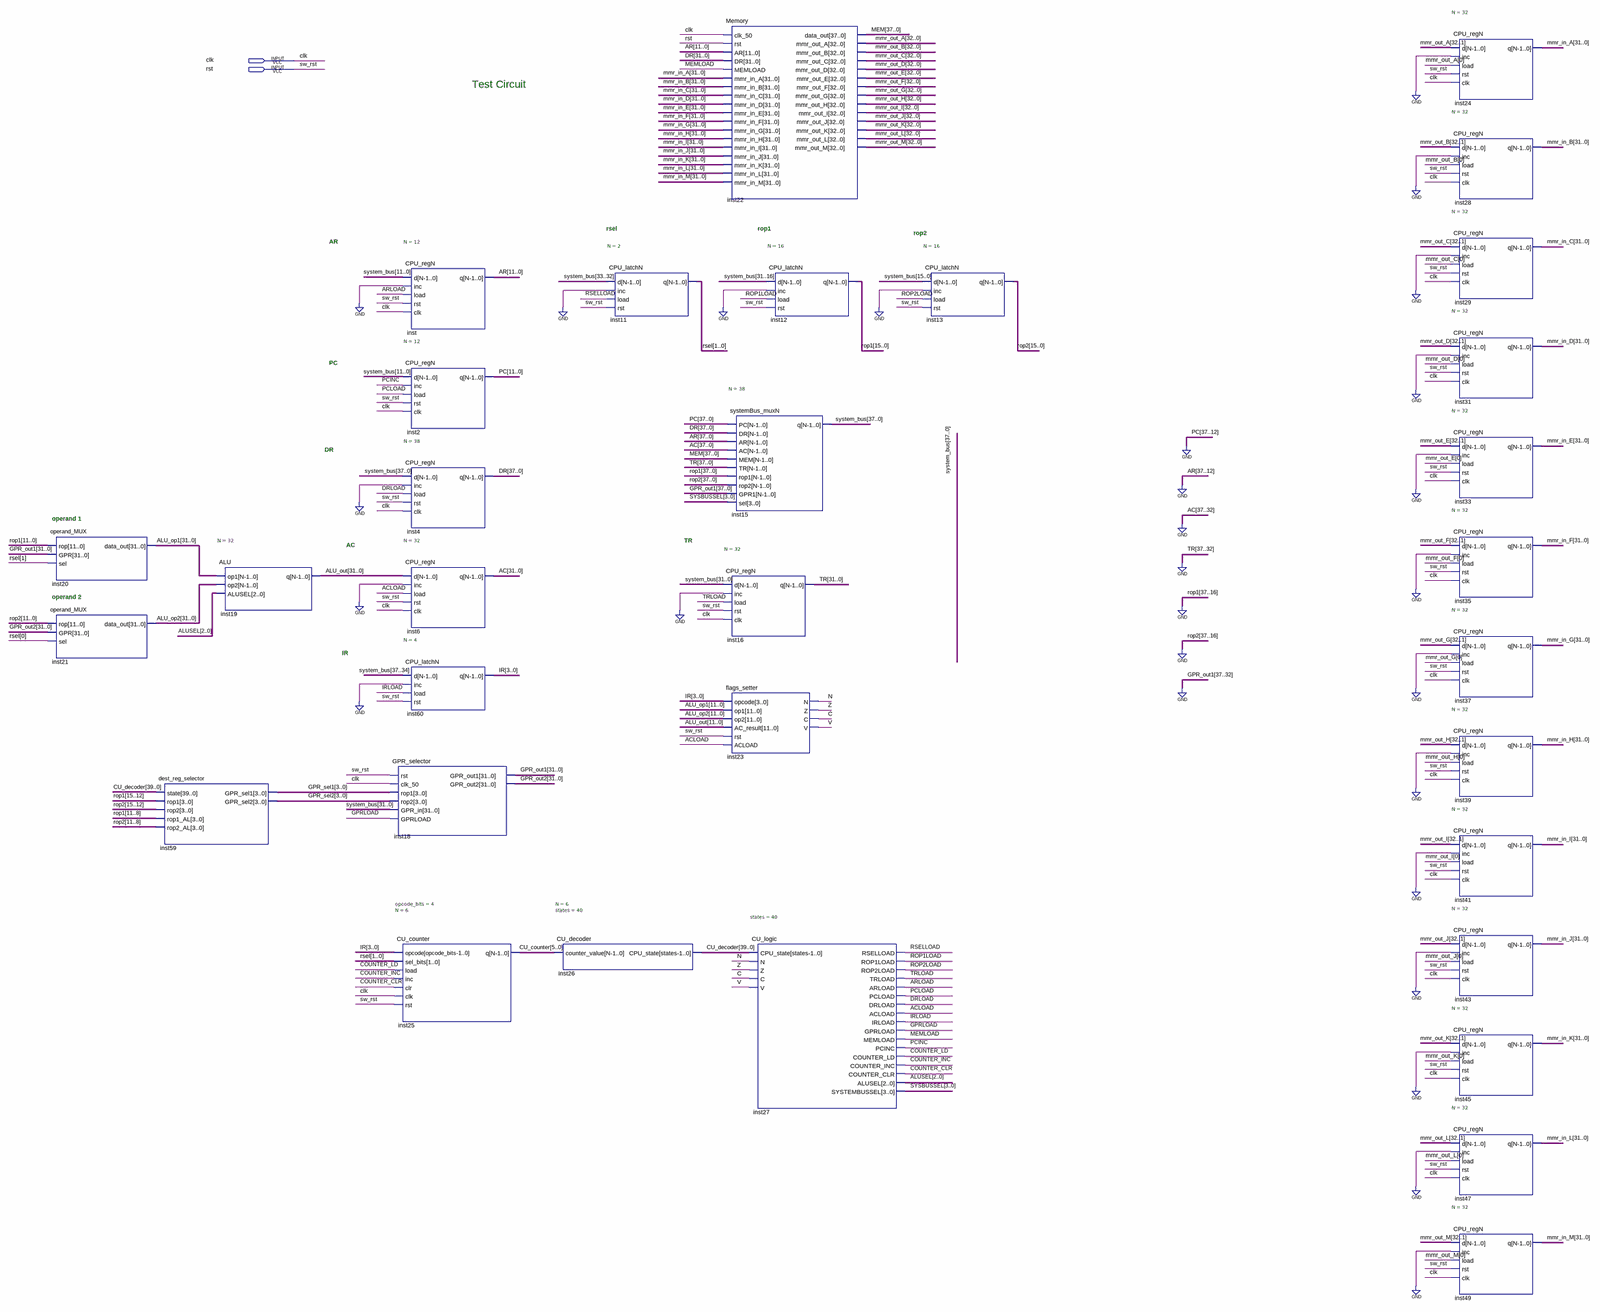
[diagram p0: schematic sheet, whole]
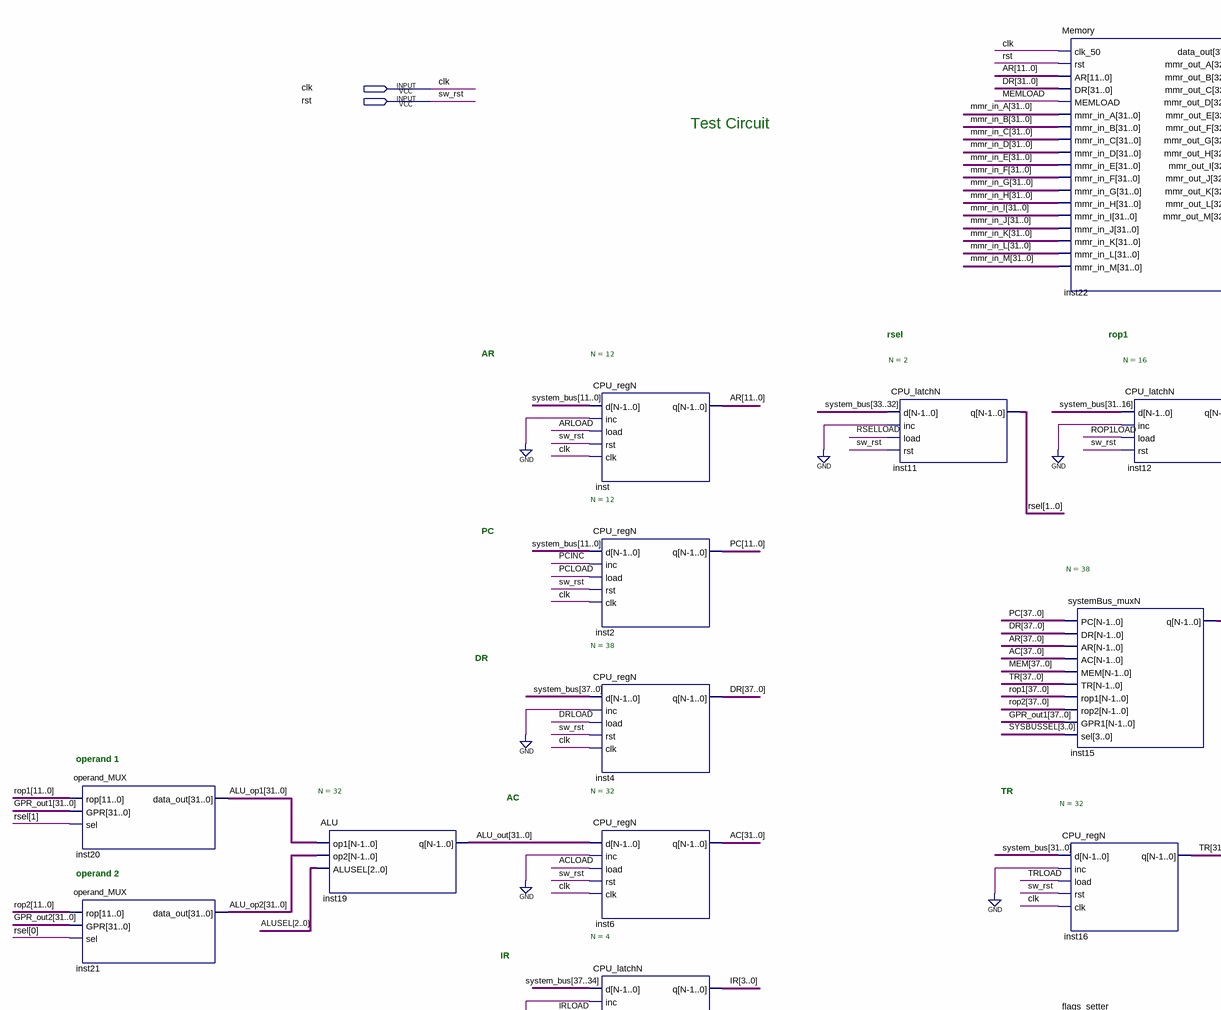
[diagram p1: schematic sheet, upper left part]
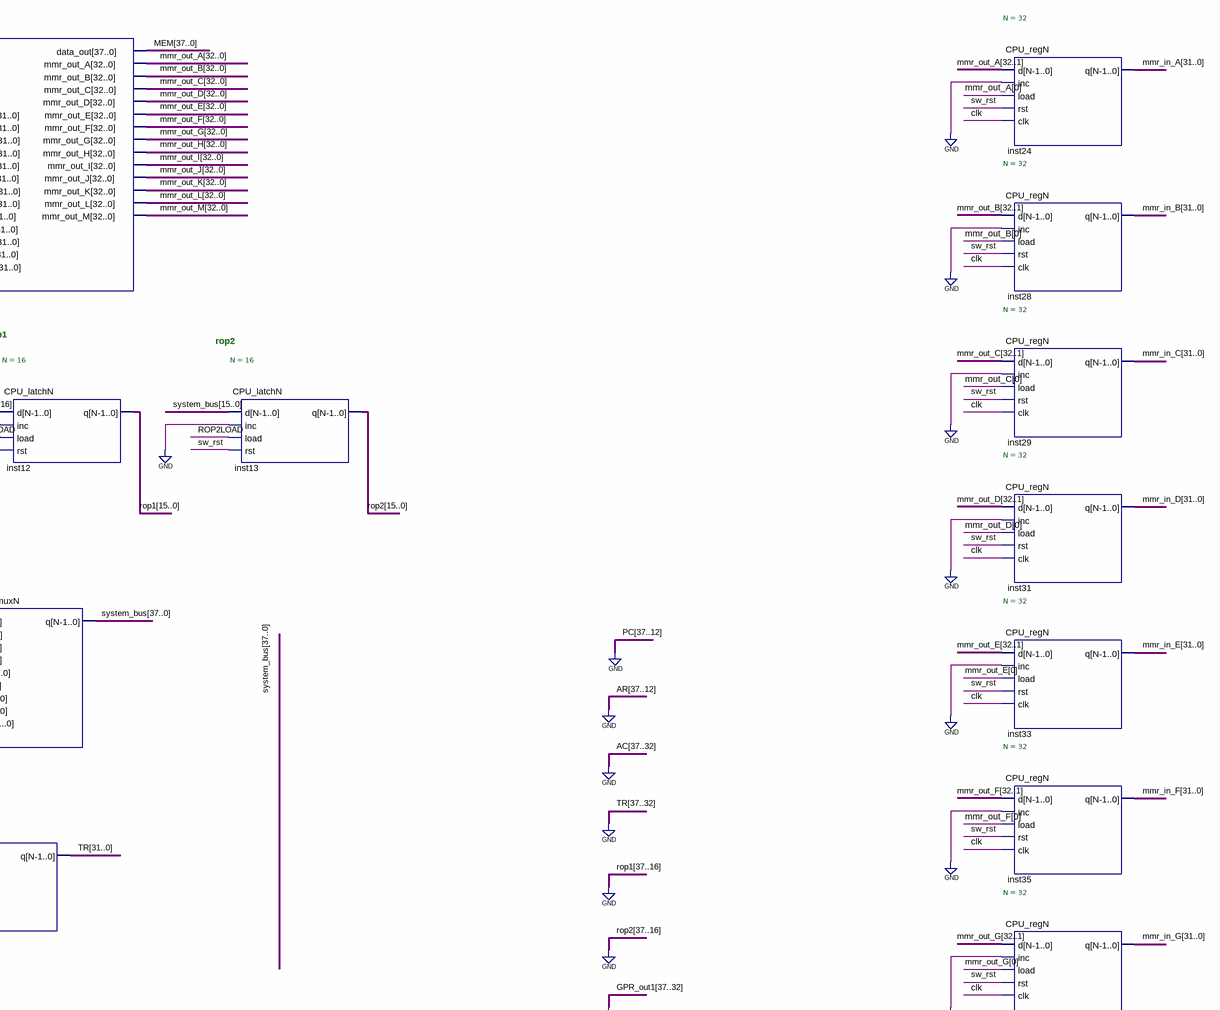
[diagram p2: schematic sheet, upper right part]
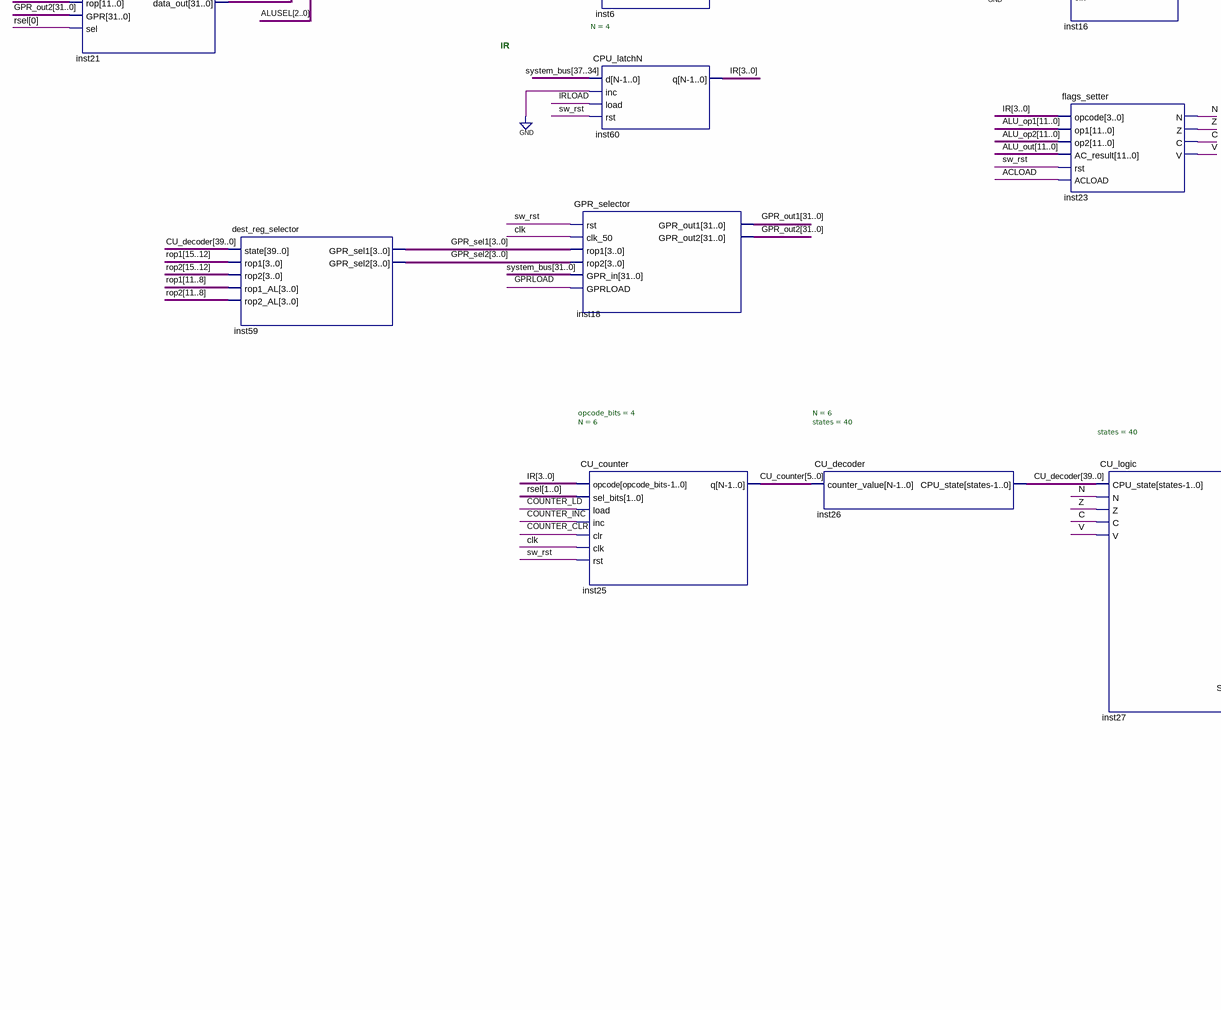
[diagram p3: schematic sheet, lower left part]
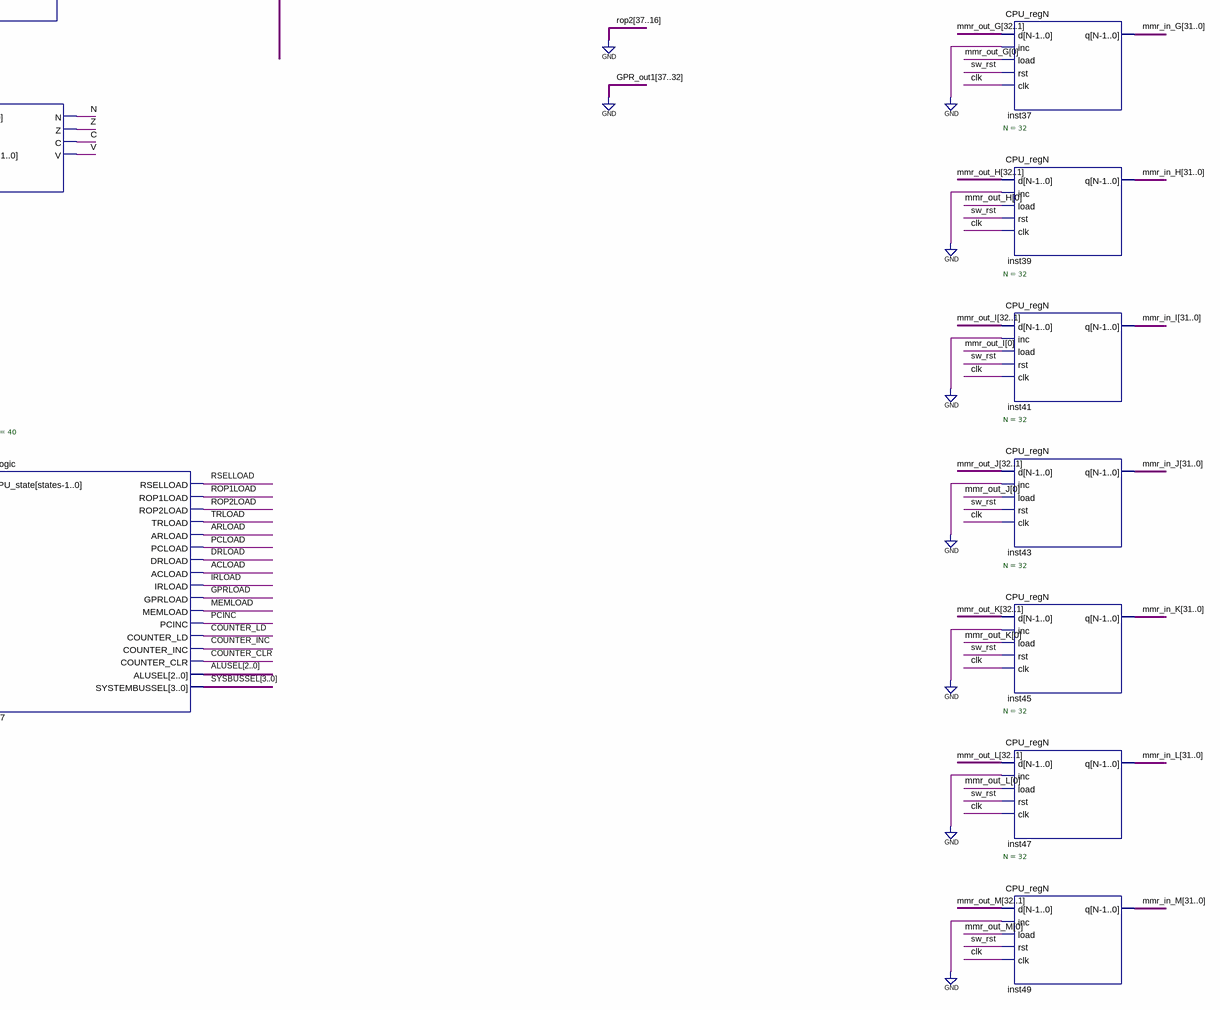
[diagram p4: schematic sheet, lower right part]
// Quartus schematic TestCircuit.bdf as structural Verilog: 33 symbols, 2 pins
module TestCircuit (
  input  clk,
  input  rst
);

  wire ACLOAD, ARLOAD, C, COUNTER_CLR, COUNTER_INC, COUNTER_LD, DRLOAD, GPRLOAD, IRLOAD, MEMLOAD, N, PCINC,
       PCLOAD, ROP1LOAD, ROP2LOAD, RSELLOAD, TRLOAD, V, Z;
  wire [1:0] rsel;
  wire [2:0] ALUSEL;
  wire [3:0] GPR_sel1, GPR_sel2, IR, SYSBUSSEL;
  wire [5:0] CU_counter;
  wire [11:0] AR, PC;
  wire [15:0] rop1, rop2;
  wire [31:0] AC, ALU_op1, ALU_op2, ALU_out, GPR_out1, GPR_out2, mmr_in_A, mmr_in_B, mmr_in_C, mmr_in_D,
       mmr_in_E, mmr_in_F, mmr_in_G, mmr_in_H, mmr_in_I, mmr_in_J, mmr_in_K, mmr_in_L, mmr_in_M, TR;
  wire [32:0] mmr_out_A, mmr_out_B, mmr_out_C, mmr_out_D, mmr_out_E, mmr_out_F, mmr_out_G, mmr_out_H,
       mmr_out_I, mmr_out_J, mmr_out_K, mmr_out_L, mmr_out_M;
  wire [37:0] DR, MEM, system_bus;
  wire [39:0] CU_decoder;

  operand_MUX inst20 (.rop(rop1[11:0]), .GPR(GPR_out1), .sel(rsel[1]), .data_out(ALU_op1));
  operand_MUX inst21 (.rop(rop2[11:0]), .GPR(GPR_out2), .sel(rsel[0]), .data_out(ALU_op2));
  dest_reg_selector inst59 (
    .state(CU_decoder), .rop1(rop1[15:12]), .rop2(rop2[15:12]), .rop1_AL(rop1[11:8]), .rop2_AL(rop2[11:8]),
    .GPR_sel1(GPR_sel1), .GPR_sel2(GPR_sel2));
  ALU #(.N(32)) inst19 (.op1(ALU_op1), .op2(ALU_op2), .ALUSEL(ALUSEL), .q(ALU_out));
  GPR_selector inst18 (
    .rst(rst), .clk_50(clk), .rop1(GPR_sel1), .rop2(GPR_sel2), .GPR_in(system_bus[31:0]), .GPRLOAD(GPRLOAD),
    .GPR_out1(GPR_out1), .GPR_out2(GPR_out2));
  CPU_regN #(.N(12)) inst (.d(system_bus[11:0]), .inc(1'b0), .load(ARLOAD), .rst(rst), .clk(clk), .q(AR));
  CPU_regN #(.N(12)) inst2 (.d(system_bus[11:0]), .inc(PCINC), .load(PCLOAD), .rst(rst), .clk(clk), .q(PC));
  CPU_regN #(.N(38)) inst4 (.d(system_bus), .inc(1'b0), .load(DRLOAD), .rst(rst), .clk(clk), .q(DR));
  CPU_regN #(.N(32)) inst6 (.d(ALU_out), .inc(1'b0), .load(ACLOAD), .rst(rst), .clk(clk), .q(AC));
  CPU_latchN #(.N(4)) inst60 (.d(system_bus[37:34]), .inc(1'b0), .load(IRLOAD), .rst(rst), .q(IR));
  CU_counter #(.opcode_bits(4), .N(6)) inst25 (
    .opcode(IR), .sel_bits(rsel), .load(COUNTER_LD), .inc(COUNTER_INC), .clr(COUNTER_CLR), .clk(clk),
    .rst(rst), .q(CU_counter));
  CU_decoder #(.N(6), .states(40)) inst26 (.counter_value(CU_counter), .CPU_state(CU_decoder));
  CPU_latchN #(.N(2)) inst11 (.d(system_bus[33:32]), .inc(1'b0), .load(RSELLOAD), .rst(rst), .q(rsel));
  Memory inst22 (
    .clk_50(clk), .rst(rst), .AR(AR), .DR(DR[31:0]), .MEMLOAD(MEMLOAD), .mmr_in_A(mmr_in_A),
    .mmr_in_B(mmr_in_B), .mmr_in_C(mmr_in_C), .mmr_in_D(mmr_in_D), .mmr_in_E(mmr_in_E), .mmr_in_F(mmr_in_F),
    .mmr_in_G(mmr_in_G), .mmr_in_H(mmr_in_H), .mmr_in_I(mmr_in_I), .mmr_in_J(mmr_in_J), .mmr_in_K(mmr_in_K),
    .mmr_in_L(mmr_in_L), .mmr_in_M(mmr_in_M), .mmr_out_A(mmr_out_A), .data_out(MEM), .mmr_out_B(mmr_out_B),
    .mmr_out_C(mmr_out_C), .mmr_out_D(mmr_out_D), .mmr_out_E(mmr_out_E), .mmr_out_F(mmr_out_F),
    .mmr_out_G(mmr_out_G), .mmr_out_H(mmr_out_H), .mmr_out_I(mmr_out_I), .mmr_out_J(mmr_out_J),
    .mmr_out_K(mmr_out_K), .mmr_out_L(mmr_out_L), .mmr_out_M(mmr_out_M));
  systemBus_muxN #(.N(38)) inst15 (
    .PC({{26{1'b0}}, PC}), .DR(DR), .AR({{26{1'b0}}, AR}), .AC({{6{1'b0}}, AC}), .MEM(MEM),
    .TR({{6{1'b0}}, TR}), .rop1({{22{1'b0}}, rop1}), .rop2({{22{1'b0}}, rop2}), .GPR1({{6{1'b0}}, GPR_out1}),
    .sel(SYSBUSSEL), .q(system_bus));
  CPU_regN #(.N(32)) inst16 (.d(system_bus[31:0]), .inc(1'b0), .load(TRLOAD), .rst(rst), .clk(clk), .q(TR));
  flags_setter inst23 (
    .opcode(IR), .op1(ALU_op1[11:0]), .op2(ALU_op2[11:0]), .AC_result(ALU_out[11:0]), .rst(rst),
    .ACLOAD(ACLOAD), .N(N), .Z(Z), .C(C), .V(V));
  CPU_latchN #(.N(16)) inst12 (.d(system_bus[31:16]), .inc(1'b0), .load(ROP1LOAD), .rst(rst), .q(rop1));
  CU_logic #(.states(40)) inst27 (
    .CPU_state(CU_decoder), .N(N), .Z(Z), .C(C), .V(V), .RSELLOAD(RSELLOAD), .ROP1LOAD(ROP1LOAD),
    .ROP2LOAD(ROP2LOAD), .TRLOAD(TRLOAD), .ARLOAD(ARLOAD), .PCLOAD(PCLOAD), .DRLOAD(DRLOAD), .ACLOAD(ACLOAD),
    .IRLOAD(IRLOAD), .GPRLOAD(GPRLOAD), .MEMLOAD(MEMLOAD), .PCINC(PCINC), .COUNTER_LD(COUNTER_LD),
    .COUNTER_INC(COUNTER_INC), .COUNTER_CLR(COUNTER_CLR), .ALUSEL(ALUSEL), .SYSTEMBUSSEL(SYSBUSSEL));
  CPU_latchN #(.N(16)) inst13 (.d(system_bus[15:0]), .inc(1'b0), .load(ROP2LOAD), .rst(rst), .q(rop2));
  CPU_regN #(.N(32)) inst24 (.d(mmr_out_A[32:1]), .inc(1'b0), .load(mmr_out_A[0]), .rst(rst), .clk(clk), .q(mmr_in_A));
  CPU_regN #(.N(32)) inst28 (.d(mmr_out_B[32:1]), .inc(1'b0), .load(mmr_out_B[0]), .rst(rst), .clk(clk), .q(mmr_in_B));
  CPU_regN #(.N(32)) inst29 (.d(mmr_out_C[32:1]), .inc(1'b0), .load(mmr_out_C[0]), .rst(rst), .clk(clk), .q(mmr_in_C));
  CPU_regN #(.N(32)) inst31 (.d(mmr_out_D[32:1]), .inc(1'b0), .load(mmr_out_D[0]), .rst(rst), .clk(clk), .q(mmr_in_D));
  CPU_regN #(.N(32)) inst33 (.d(mmr_out_E[32:1]), .inc(1'b0), .load(mmr_out_E[0]), .rst(rst), .clk(clk), .q(mmr_in_E));
  CPU_regN #(.N(32)) inst35 (.d(mmr_out_F[32:1]), .inc(1'b0), .load(mmr_out_F[0]), .rst(rst), .clk(clk), .q(mmr_in_F));
  CPU_regN #(.N(32)) inst37 (.d(mmr_out_G[32:1]), .inc(1'b0), .load(mmr_out_G[0]), .rst(rst), .clk(clk), .q(mmr_in_G));
  CPU_regN #(.N(32)) inst39 (.d(mmr_out_H[32:1]), .inc(1'b0), .load(mmr_out_H[0]), .rst(rst), .clk(clk), .q(mmr_in_H));
  CPU_regN #(.N(32)) inst41 (.d(mmr_out_I[32:1]), .inc(1'b0), .load(mmr_out_I[0]), .rst(rst), .clk(clk), .q(mmr_in_I));
  CPU_regN #(.N(32)) inst43 (.d(mmr_out_J[32:1]), .inc(1'b0), .load(mmr_out_J[0]), .rst(rst), .clk(clk), .q(mmr_in_J));
  CPU_regN #(.N(32)) inst45 (.d(mmr_out_K[32:1]), .inc(1'b0), .load(mmr_out_K[0]), .rst(rst), .clk(clk), .q(mmr_in_K));
  CPU_regN #(.N(32)) inst47 (.d(mmr_out_L[32:1]), .inc(1'b0), .load(mmr_out_L[0]), .rst(rst), .clk(clk), .q(mmr_in_L));
  CPU_regN #(.N(32)) inst49 (.d(mmr_out_M[32:1]), .inc(1'b0), .load(mmr_out_M[0]), .rst(rst), .clk(clk), .q(mmr_in_M));

  // Other names for the same wires on the sheet: sw_rst = rst

  // Notes on the sheet:
  //   Test Circuit
  //   rsel
  //   rop1
  //   rop2
  //   AR
  //   PC
  //   DR
  //   operand 1
  //   TR
  //   AC
  //   operand 2
  //   IR
endmodule
